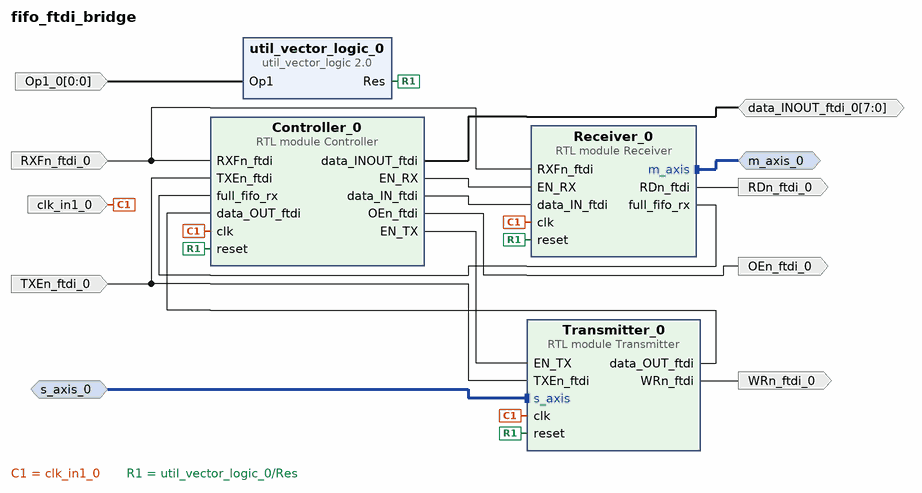
[diagram p0: block diagram of the top level]
# Vivado block design fifo_ftdi_bridge, xc7a100tcsg324-1, Vivado 2021.1
create_bd_design fifo_ftdi_bridge

create_bd_intf_port -mode Slave -vlnv xilinx.com:interface:axis_rtl:1.0 s_axis_0
set_property -dict [list \
  CONFIG.FREQ_HZ 100000000 \
  CONFIG.HAS_TKEEP 0 \
  CONFIG.HAS_TLAST 0 \
  CONFIG.HAS_TREADY 1 \
  CONFIG.HAS_TSTRB 0 \
  CONFIG.LAYERED_METADATA undef \
  CONFIG.TDATA_NUM_BYTES 1 \
  CONFIG.TDEST_WIDTH 0 \
  CONFIG.TID_WIDTH 0 \
  CONFIG.TUSER_WIDTH 0 \
] [get_bd_intf_ports s_axis_0]
create_bd_intf_port -mode Master -vlnv xilinx.com:interface:axis_rtl:1.0 m_axis_0
set_property -dict {CONFIG.FREQ_HZ 100000000} [get_bd_intf_ports m_axis_0]
create_bd_port -dir I RXFn_ftdi_0
create_bd_port -dir I TXEn_ftdi_0
create_bd_port -dir O WRn_ftdi_0
create_bd_port -dir O OEn_ftdi_0
create_bd_port -dir O RDn_ftdi_0
create_bd_port -dir I -from 0 -to 0 Op1_0
create_bd_port -dir I -type clk clk_in1_0
set_property -dict {CONFIG.FREQ_HZ 100000000} [get_bd_ports clk_in1_0]
create_bd_port -dir IO -from 7 -to 0 data_INOUT_ftdi_0

create_bd_cell -type ip -vlnv xilinx.com:ip:util_vector_logic:2.0 util_vector_logic_0
set_property -dict {CONFIG.C_OPERATION not CONFIG.C_SIZE 1} [get_bd_cells util_vector_logic_0]
create_bd_cell -type module -reference Receiver Receiver_0
create_bd_cell -type module -reference Controller Controller_0
create_bd_cell -type module -reference Transmitter Transmitter_0

# ---- connections ----

connect_bd_intf_net [get_bd_intf_ports m_axis_0] [get_bd_intf_pins Receiver_0/m_axis]
connect_bd_intf_net -intf_net s_axis_0_1 [get_bd_intf_ports s_axis_0] [get_bd_intf_pins Transmitter_0/s_axis]
connect_bd_net [get_bd_pins Controller_0/EN_RX] [get_bd_pins Receiver_0/EN_RX]
connect_bd_net [get_bd_pins Controller_0/EN_TX] [get_bd_pins Transmitter_0/EN_TX]
connect_bd_net [get_bd_pins Controller_0/OEn_ftdi] [get_bd_ports OEn_ftdi_0]
connect_bd_net -net Controller_0_WRn_ftdi [get_bd_pins Transmitter_0/WRn_ftdi] [get_bd_ports WRn_ftdi_0]
connect_bd_net [get_bd_pins Controller_0/data_IN_ftdi] [get_bd_pins Receiver_0/data_IN_ftdi]
connect_bd_net [get_bd_ports data_INOUT_ftdi_0] [get_bd_pins Controller_0/data_INOUT_ftdi]
connect_bd_net -net Op1_0_1 [get_bd_ports Op1_0] [get_bd_pins util_vector_logic_0/Op1]
connect_bd_net -net RXFn_ftdi_0_1 [get_bd_ports RXFn_ftdi_0] [get_bd_pins Receiver_0/RXFn_ftdi] [get_bd_pins Controller_0/RXFn_ftdi]
connect_bd_net [get_bd_pins Receiver_0/RDn_ftdi] [get_bd_ports RDn_ftdi_0]
connect_bd_net [get_bd_pins Receiver_0/full_fifo_rx] [get_bd_pins Controller_0/full_fifo_rx]
connect_bd_net -net TXEn_ftdi_0_1 [get_bd_ports TXEn_ftdi_0] [get_bd_pins Controller_0/TXEn_ftdi] [get_bd_pins Transmitter_0/TXEn_ftdi]
connect_bd_net [get_bd_pins Transmitter_0/data_OUT_ftdi] [get_bd_pins Controller_0/data_OUT_ftdi]
connect_bd_net -net clk_wiz_clk_out1 [get_bd_ports clk_in1_0] \
  [get_bd_pins Receiver_0/clk] [get_bd_pins Controller_0/clk] [get_bd_pins Transmitter_0/clk]
connect_bd_net [get_bd_pins util_vector_logic_0/Res] [get_bd_pins Receiver_0/reset] [get_bd_pins Controller_0/reset] [get_bd_pins Transmitter_0/reset]

validate_bd_design
save_bd_design
